# EAGLE design design1 (EAGLE 7.3.0)
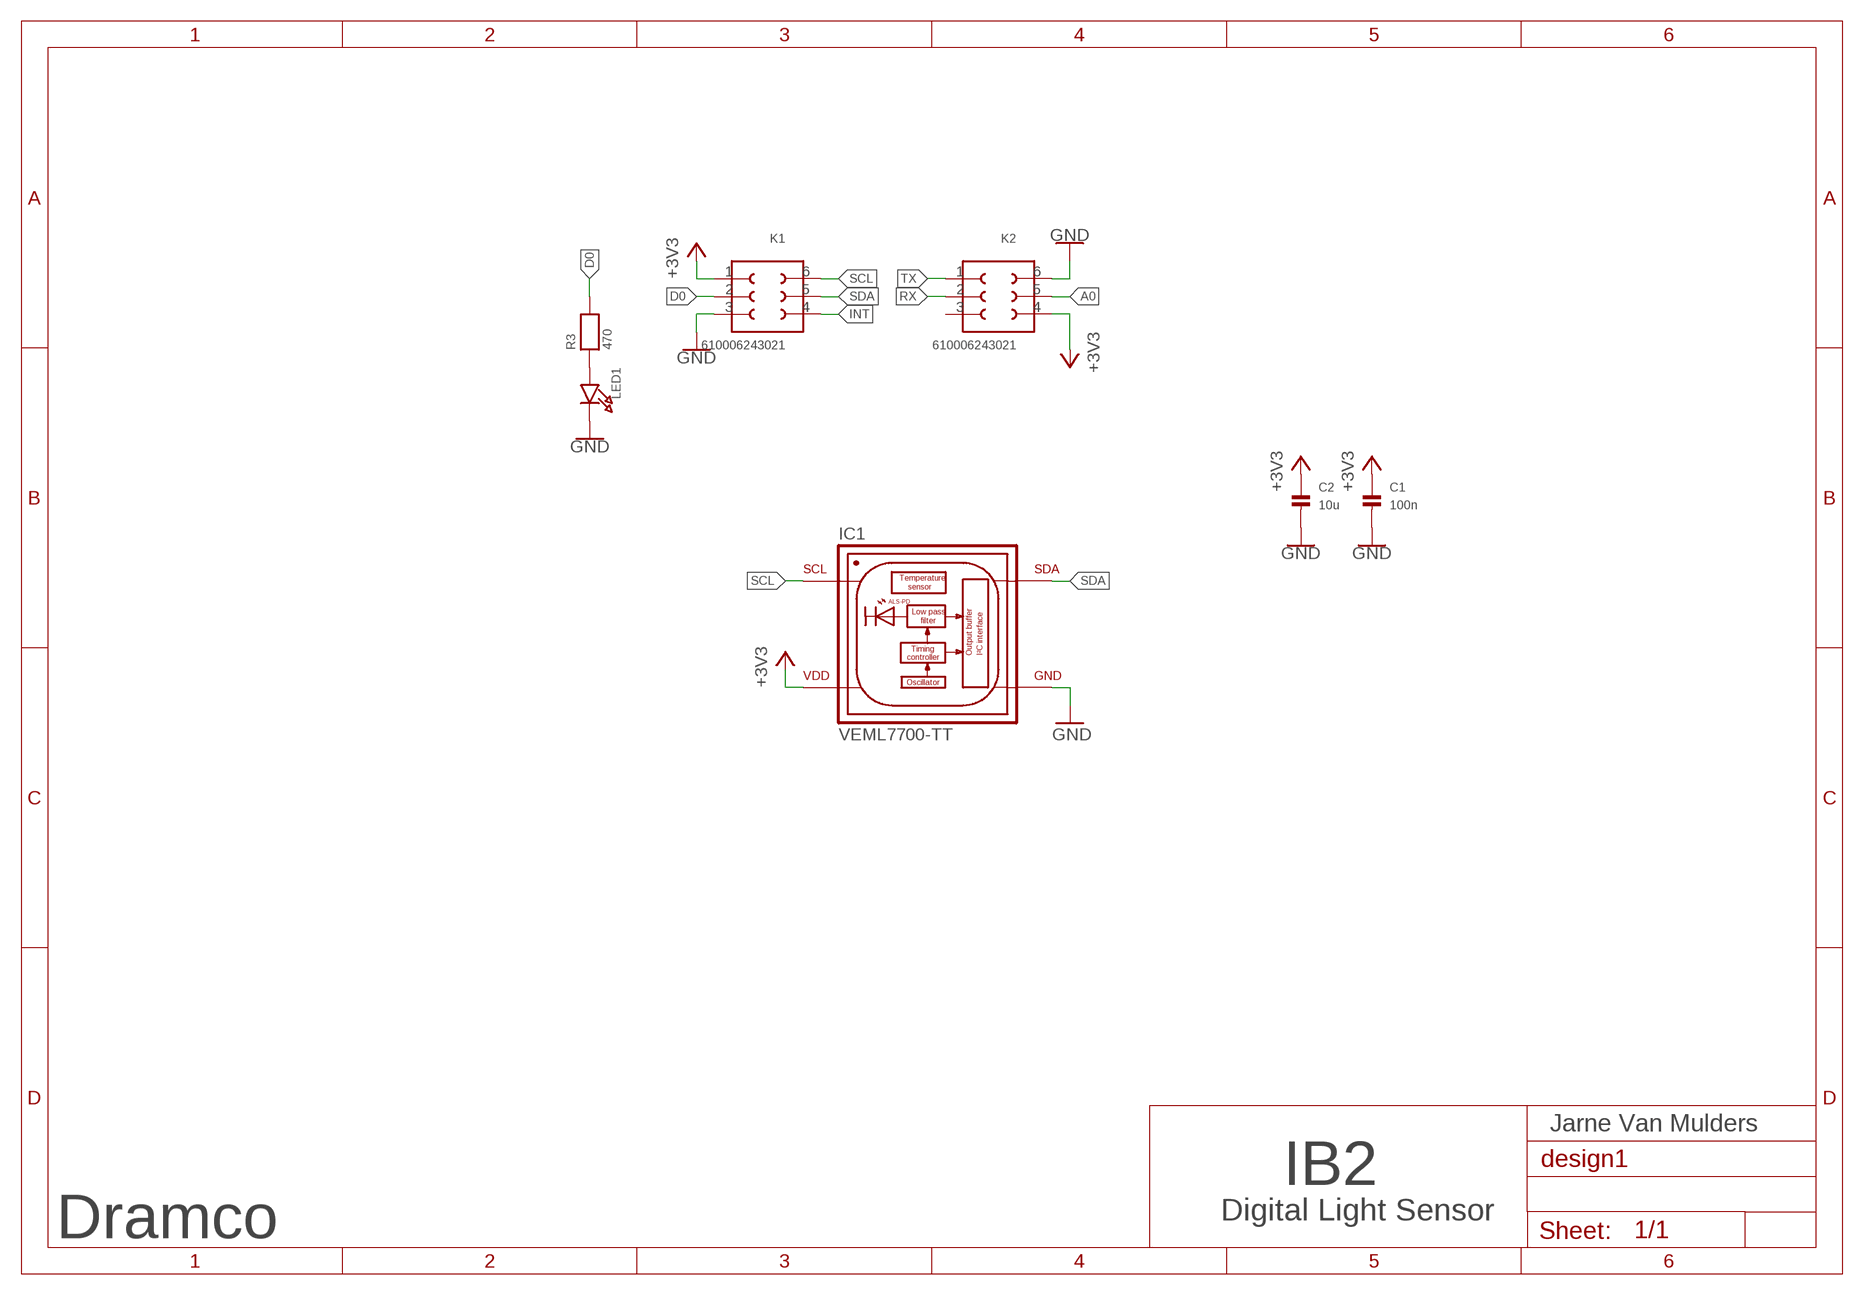
[diagram p0: schematic, sheet 1]

## Parts
C1  100n  CAP_CERAMIC0603  [0603]
C2  10u  CAP_CERAMIC0805  [0805]
IC1  VEML7700-TT  [XDCR_VEML7700-TT]
K1  610006243021  [610006243021]
K2  610006243021  [610006243021]
LED1  LED0805  [CHIPLED_0805]
R3  470  RESISTOR0603  [0603]

## Nets
A0: K2.5
D0: K1.2 R3.2
GND: C1.2 C2.2 IC1.3(GND) K1.3 K2.6 LED1.C
INT: K1.4
N$3: LED1.A R3.1
N$5: C1.1 C2.1 IC1.2(VDD) K1.1 K2.4 ; supply symbol labelled +3V3
RX: K2.2
SCL: IC1.1(SCL) K1.6
SDA: IC1.4(SDA) K1.5
TX: K2.1
Unconnected: K2.3

## Notes on the sheet
- Jarne Van Mulders
- IB2
- Digital Light Sensor
- Dramco

## Library data of the parts
C1 C2 = microbuilder:CAP_CERAMIC: Ceramic Capacitors 0402 - 0402 Surface Mount Capacitors 16pF 50V 5% [Digikey: 445-4899-2-ND] 18pF 50V 5% [Digikey: 490-1281-2-ND] 22pF 50V 5% [Digikey: 490-1283-2-ND] 68pF 50V 5% [Digikey: 490-1289-2-ND] 0.1uF 10V 10% [Digikey: 490-1318-2-ND] 1.0uF 6.3V 10% [Digikey: 490-1320-2-ND] 0603 - 0603 Surface Mount Capacitors 16 pF 50V 5% [Digikey: 445-5051-2-ND] 22 pF 50V [Digikey: PCC220ACVTR-ND] 33 pF 50V 5% [Digikey: 490-1415-1-ND] 56pF 50V 5% [Digikey: 490-1421-1-ND] 220pF 50V 5% [Digikey: 445-1285-1-ND] 680 pF 50V 2200 pF 50V 5% C0G [Digikey: 445-1297-1-ND] 5600 pF 100V 5% X7R [Digikey: 478-3711-1-ND] 0.1 µF 25V 10% [Digikey: PCC2277TR-ND] 0.22 µF 16V 10% X7R [Digikey: 445-1318-1-ND] 1.0 µF 25V 10% [Digikey: 445-5146-2-ND] 0603 - RF Specific 3pF 250V +/-0.1pF RF [Digikey: 712-1347-1-ND] 18 pF 250V 5% [Digikey: 478-3505-1-ND or 712-1322-1-ND] 56 pF 250V 5% C0G RF [Digikey: 490-4867-1-ND] 68 pF 250V RF [Digikey: 490-4868-1-ND] 0805 - 0805 Surface Mount Capacitors 220 pF 250V 2% RF Ceramic Capacitor [Digikey: 712-1398-1-ND] 1000 pF 50V 2% NP0 Ceramic Capacitor [Digikey: 478-3760-1-ND] 0.1 µF 25V 10% Ceramic Capacitor [Digikey: PCC1828TR-ND] 1.0 µF 16V 10% Ceramic Capacitor[Digikey: 490-1691-2-ND] 10.0 µF 10V 10% Ceramic Capacitor[Digikey: 709-1228-1-ND] 10.0 uF 16V 10% Ceramic Capacitor [Digikey: 478-5165-2-ND] 47 uF 6.3V 20% Ceramic Capacitor [Digikey: 587-1779-1-ND or 399-5506-1-ND] 1206 - 1206 Surface Mount Capacitors 47uF 10V 20% Ceramic Capacitor [Digikey: 490-5528-1-ND or 399-5508-1-ND or 445-6010-1-ND] 100uF 6.3V -20%, +80% Y5V Ceramic Capacitor (Digikey: 490-4512-1-ND, Mouser: 81-GRM31CF50J107ZE1L)
IC1 = VEML7700-TT:VEML7700-TT: Ambient Light Sensors Opr 2.5-3.6V 0.005lx Top View 16bit I2C Check prices <https://pricing.snapeda.com/parts/VEML7700-TT/Vishay%20Semiconductor/view-part?ref=eda>; AVAILABILITY: In Stock; DESCRIPTION: Optical Sensor 4-SMD, J-Lead; MF: Vishay Semiconductor; MP: VEML7700-TT; PACKAGE: SMD-4 Vishay Semiconductor; PRICE: None
K1 K2 = Wurth_Elektronik_Electromechanic_Board_to_Board_Connectors_rev15c:610006243021: WR-PHD 2.54mm SMT Dual Socket Header Bottom Entry, 6 Pins=>Code : Con_BTB_SHD_2.54_2_610006243021 <http://katalog.we-online.de/media/images/eican/Con_BTB_SHD_2.54_2_6100xx243021_pf2.jpg> Details see: http://katalog.we-online.de/en/em/610_0xx_243_021 Created 2014-05-30, Karrer Zheng 2014 (C) Würth Elektronik
LED1 = microbuilder:LED: LED 0603 - 0603 Surface Mount Package 2mA: Green LED - Low Power (3.9mcd, 2ma, 1.7Vf) - Digikey: 475-2709-2-ND Orange LED - Low Power (9.8mcd, 2ma, 1.8Vf) - Digikey: 475-1194-2-ND Red LED - Low Power (5mcd, 2ma, 1.8Vf) - Digikey: 475-1195-2-ND Yellow LED - Low Power (7mcd, 2ma, 1.8Vf) - Digikey: 475-1196-2-ND 5mA: Blue LED - Low Power (17mcd, 5ma, 2.9Vf) - Digikey: LNJ937W8CRACT-ND 0805 - 0805 Surface Mount Package 2mA: Red LED (8.8mcd, 2mA, 1.8Vf, Clear) - Low Power [Digikey: 475-2510-1-ND] Green LED (5mcd, 2mA, 1.8Vf, Clear) - Low Power [Digikey: 475-2730-1-ND] Yellow LED (11.3mcd, 2mA, 1.8Vf, Clear) - Low Power [Digikey: 475-2555-1-ND] 20mA: Red LED (104mcd, 20mA, Diffused) - LS R976 [Digikey: 475-1278-6-ND] Red LED (12mcd, 20mA, 2.0Vf, Clear) - APT2012EC [Digikey: 754-1128-1-ND] Green LED (15mcd, 20mA, 2.2Vf, Clear) - APT2012GC [Digikey: 754-1131-1-ND] Orange LED (160mcd, 20mA, 2.1Vf, Clear) - APT2012SECK [Digikey: 754-1130-1-ND] 1206 - 1206 Surface Mount Package Green LED (26mcd, 20mA, Diffused) - LG N971 [Digikey: 475-1407-6-ND] Red LED (15mcd, 20mA, Diffused) - LH N974 [Digikey: 475-1416-6-ND]
R3 = microbuilder:RESISTOR: Resistors 0402 - 0402 Surface Mount Package 22 Ohm 1% 1/16W [Digikey: 311-22.0LRTR-ND] 33 Ohm 5% 1/16W 1.0K 5% 1/16W 1.5K 5% 1/16W 2.0K 1% 1/16W 10.0K 1% 1/16W [Digikey: 311-10.0KLRTR-ND] 10.0K 5% 1/16W [Digikey: RMCF0402JT10K0TR-ND] 12.1K 1% 1/16W [Digikey: 311-22.0LRTR-ND] 100.0K 5% 1/16W 0603 - 0603 Surface Mount Package 0 Ohm 1/10 Watt 1% Resistor 15 Ohm 1/10 Watt 1% Resistor 33 Ohm 1/10 Watt 1% Resistor 49.9 Ohm 1/10 Watt 1% Resistor 100 Ohm 1/10 Watt 1% Resistor 150 Ohm 1/10 Watt 1% Resistor 240 Ohm 1/10 Watt 1% Resistor 390 Ohm 1/10 Watt 1% Resistor 560 Ohm 1/10 Watt 1% Resistor 680 Ohm 1/10 Watt 1% Resistor 750 Ohm 1/10 Watt 1% Resistor 1.0K Ohm 1/10 Watt 1% Resistor 1.5K Ohm 1/10 Watt 1% Resistor 2.0K Ohm 1/10 Watt 1% Resistor 2.2K Ohm 1/10 Watt 1% Resistor 3.3K Ohm 1/10 Watt 1% Resistor 4.7K Ohm 1/10 Watt 1% Resistor 10.0K Ohm 1/10 Watt 1% Resistor 12.0K Ohm 1/10 Watt 1% Resistor 12.1K Ohm 1/10 Watt 1% Resistor 20.0K Ohm 1/10 Watt 1% Resistor 33.0K Ohm 1/10 Watt 1% Resistor 100.0K Ohm 1/10 Watt 1% Resistor 0805 - 0805 Surface Mount Package 0 Ohm 1/8 Watt 1% Resistor 33 Ohm 1/8 Watt 1% Resistor 100 Ohm 1/8 Watt 1% Resistor 150 Ohm 1/8 Watt 1% Resistor 200 Ohm 1/8 Watt 1% Resistor 240 Ohm 1/8 Watt 1% Resistor 330 Ohm 1/8 Watt 1% Resistor 390 Ohm 1/8 Watt 1% Resistor 470 Ohm 1/8 Watt 1% Resistor 1.0K Ohm 1/8 Watt 1% Resistor 1.5K Ohm 1/8 Watt 1% Resistor 2.0K Ohm 1/8 Watt 1% Resistor 4.7K Ohm 1/8 Watt 1% Resistor 5.1K Ohm 1/8 Watt 1% Resistor 5.6K Ohm 1/8 Watt 1% Resistor 10.0K Ohm 1/8 Watt 1% Resistor 22.0K Ohm 1/8 Watt 1% Resistor 33.0K Ohm 1/8 Watt 1% Resistor 100K Ohm 1/8 Watt 1% Resistor 1206 - 1206 Surface Mount Package 2012 - 2010 Surface Mount Package 0.11 Ohm 1/2 Watt 1% Resistor - Digikey: RHM.11UCT-ND

## Net classes
0 default: clearance 0.205 mm

## Board
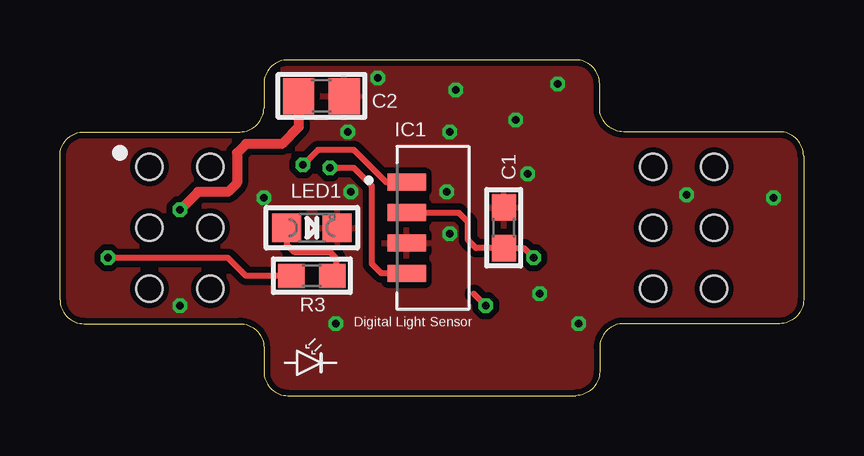
[diagram p1: board, top side]
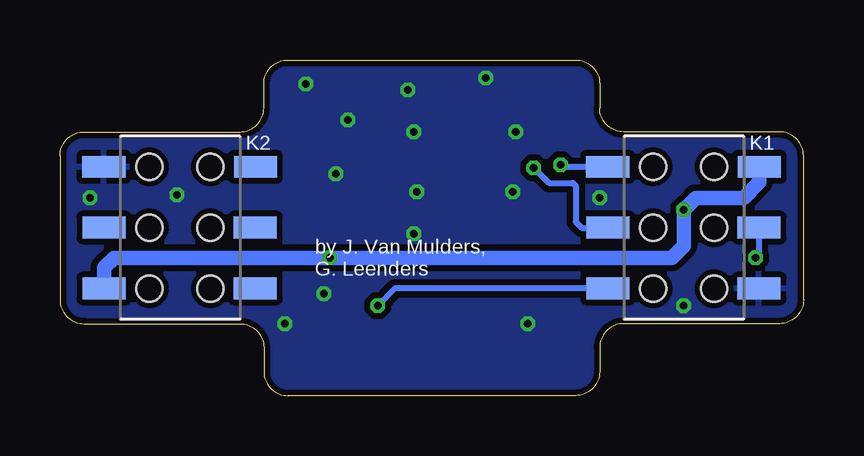
[diagram p2: board, bottom side, seen from below]

Size 31 x 14 mm. Coordinates in mm from the lower left corner, seen from the top.
Outline: 0,4 0,10 arc-90 1,11 7.5,11 arc90 8.5,12 8.5,13 arc-90 9.5,14 21.5,14 arc-90 22.5,13 22.5,12 arc90 23.5,11 30,11 arc-90 31,10 31,4 arc-90 30,3 23.5,3 arc90 22.5,2 22.5,1 arc-90 21.5,0 9.5,0 arc-90 8.5,1 8.5,2 arc90 7.5,3 1,3 arc-90 0,4
Copper layers (1*16): Top 0.035mm / dielectric 1.5mm / Bottom 0.035mm
Design rules "SeeedStudio_2layer_DRU_no_angle_20140221-2": minimum track width 6mil, minimum drill 12mil, track to track 6mil, track to pad 6mil, pad to pad 6mil, via to via 6mil, smd to smd 0mil, copper to edge 10mil, drill to drill 10mil, minimum pad ring 10mil, minimum via ring 6mil, stop-mask expansion 2mil, vias tented up to drill 100mil, thermal gap 10mil

### Footprints (pad centres in the part's own frame; a part is rotated, then mirrored left to right if it is on the bottom)
0603 = smd 1.1 x 1: 1 -0.85,0; 2 0.85,0
0805 = smd 1.3 x 1.5: 1 -0.95,0; 2 0.95,0
XDCR_VEML7700-TT = smd 1.6 x 0.7: 1 -1.55,1.905; 2 -1.55,0.635; 3 -1.55,-0.635; 4 -1.55,-1.905
610006243021 = smd 0.9 x 1.8: 1 -2.54,3.15; 2 -0.01,3.14; 3 2.53,3.14; 4 2.53,-3.16; 5 -0.01,-3.16; 6 -2.54,-3.17 | hole 1.1: -2.54,1.27; 0,1.27; 0,-1.27; -2.54,-1.27; 2.54,1.27; 2.54,-1.27
CHIPLED_0805 = smd 1.2 x 1.2: A 0,-1.05; C 0,1.05

### Placement (x,y rotation side)
C1  18.5,7 90 top
C2  10.9,12.5 0 top
IC1  16,7 0 top
K1  5,7 270 bottom
K2  26,7 270 bottom
LED1  10.5,7 270 top
R3  10.5,5 180 top

### Tracks (layer width: path | path; a pad name or v marks a point on that pad's centre or on a via)
D0  (via drill 0.31)
  Top 0.254: R3.2 7.75,5 7,5.75 v2,5.75
  Bottom 0.254: K1.2 1.86,5.86 v2,5.75
GND  (via drill 0.31)
  other vias: 16.25,11 16.12,8.5 16.25,6.75 13.25,13.25 20.75,13 16.5,12.75 5,3.75 29.75,8.25 19.5,9.25 19,11.5 20,4.25 11.5,3 12,11 8.5,8.25 21.62,3 26.12,8.38 12.12,8.5
  pour Bottom (isolate 0.254): -3.5,17 34.25,17 34.25,-3.75 -3.5,-3.75
  pour Top (isolate 0.254): -3.75,18.75 36.75,18.75 36.75,-4.75 -3.25,-4.75 arc-90 -3.75,-4.25
INT  (via drill 0.31)
  Top 0.254: v17.75,3.75 17.25,4.25
  Bottom 0.254: K1.4 17.03,4.47 v17.75,3.75
N$3
  Top 0.254: LED1.A 9.45,6.3 9.75,6 11.25,6 11.5,5.75 11.5,5.15 R3.1
N$5  (via drill 0.31)
  Top 0.254: v19.75,5.75 19.35,6.15 C1.1 17.35,6.15 17,6.5 17,7.25 16.61,7.63 IC1.2
  Top 0.406: C2.1 9.95,11.2 9.25,10.5 7.75,10.5 7.38,10.12 7.38,8.88 7,8.5 5.75,8.5 v5,7.75
  Bottom 0.61: K1.1 1.85,8.9 2.5,8.25 4.5,8.25 v5,7.75 5,6.25 5.5,5.75 v19.75,5.75 28.75,5.75 29.16,5.34 K2.4
SCL  (via drill 0.31)
  Top 0.254: IC1.1 13.6,8.91 12.25,10.25 10.75,10.25 v10.12,9.62
  Bottom 0.254: K1.6 10.04,9.54 v10.12,9.62
SDA  (via drill 0.31)
  Top 0.254: IC1.4 13.4,5.09 13,5.5 13,8.75 12.25,9.5 v11.25,9.5
  Bottom 0.254: v11.25,9.5 10.62,8.88 9.62,8.88 9.5,8.75 9.5,7.25 9.25,7 K1.5

### Text on the board
tPlace: Digital Light Sensor
bPlace: by J. Van Mulders, / G. Leenders
bStop: CONTROLLER